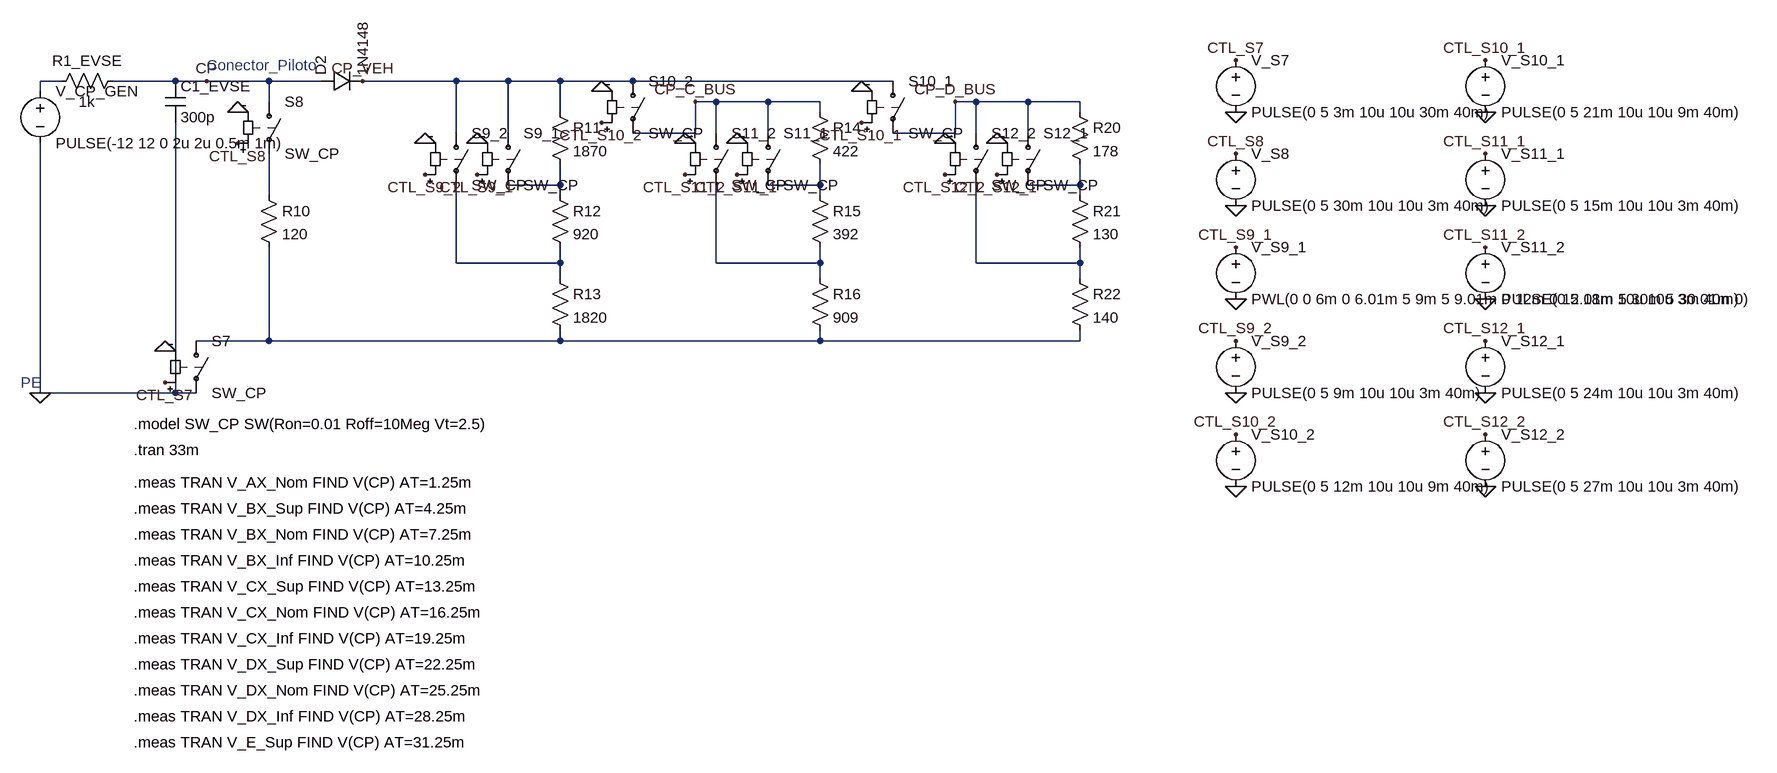
[diagram p0: schematic teste3.asc]
teste3.asc, the LTspice schematic file:
Version 4.1
SHEET 1 2500 1200
WIRE -208 48 -240 48
WIRE -240 48 -240 64
WIRE -32 48 -128 48
WIRE 16 48 -32 48
WIRE 112 48 16 48
WIRE 192 48 112 48
WIRE 112 80 112 48
WIRE 112 224 112 160
WIRE 112 448 112 304
WIRE 400 48 256 48
WIRE 480 48 400 48
WIRE 560 48 480 48
WIRE 672 48 560 48
WIRE 1072 48 672 48
WIRE 560 96 560 48
WIRE 560 224 560 176
WIRE 560 352 560 304
WIRE 560 448 560 432
WIRE 480 128 480 48
WIRE 560 208 480 208
WIRE 400 128 400 48
WIRE 400 328 400 208
WIRE 560 328 400 328
WIRE 768 128 672 128
WIRE 768 80 768 128
WIRE 800 80 768 80
WIRE 880 80 800 80
WIRE 960 80 880 80
WIRE 960 96 960 80
WIRE 960 224 960 176
WIRE 960 352 960 304
WIRE 960 448 960 432
WIRE 880 128 880 80
WIRE 960 208 880 208
WIRE 800 128 800 80
WIRE 800 328 800 208
WIRE 960 328 800 328
WIRE 1168 128 1072 128
WIRE 1168 80 1168 128
WIRE 1200 80 1168 80
WIRE 1280 80 1200 80
WIRE 1360 80 1280 80
WIRE 1360 96 1360 80
WIRE 1360 224 1360 176
WIRE 1360 352 1360 304
WIRE 1360 448 1360 432
WIRE 1280 128 1280 80
WIRE 1360 208 1280 208
WIRE 1200 128 1200 80
WIRE 1200 328 1200 208
WIRE 1360 328 1200 328
WIRE 112 448 0 448
WIRE 560 448 112 448
WIRE 960 448 560 448
WIRE 1360 448 960 448
WIRE -32 528 0 528
WIRE -240 528 -32 528
WIRE -240 528 -240 144
WIRE -32 528 -32 112
FLAG 16 48 CP
FLAG 256 48 CP_VEH
FLAG 768 80 CP_C_BUS
FLAG 1168 80 CP_D_BUS
FLAG -240 528 0
TEXT -270 512 Left 2 PE
TEXT 16 24 Left 2 Conector_Piloto
FLAG 64 96 0
FLAG 64 144 CTL_S8
FLAG 432 144 0
FLAG 432 192 CTL_S9_1
FLAG 352 144 0
FLAG 352 192 CTL_S9_2
FLAG 624 64 0
FLAG 624 112 CTL_S10_2
FLAG 1024 64 0
FLAG 1024 112 CTL_S10_1
FLAG 832 144 0
FLAG 832 192 CTL_S11_1
FLAG 752 144 0
FLAG 752 192 CTL_S11_2
FLAG 1232 144 0
FLAG 1232 192 CTL_S12_1
FLAG 1152 144 0
FLAG 1152 192 CTL_S12_2
FLAG -48 464 0
FLAG -48 512 CTL_S7
FLAG 1600 96 0
FLAG 1600 16 CTL_S7
FLAG 1600 240 0
FLAG 1600 160 CTL_S8
FLAG 1600 384 0
FLAG 1600 304 CTL_S9_1
FLAG 1600 528 0
FLAG 1600 448 CTL_S9_2
FLAG 1600 672 0
FLAG 1600 592 CTL_S10_2
FLAG 1984 96 0
FLAG 1984 16 CTL_S10_1
FLAG 1984 240 0
FLAG 1984 160 CTL_S11_1
FLAG 1984 384 0
FLAG 1984 304 CTL_S11_2
FLAG 1984 528 0
FLAG 1984 448 CTL_S12_1
FLAG 1984 672 0
FLAG 1984 592 CTL_S12_2
SYMBOL voltage -240 48 R0
WINDOW 123 0 0 Left 0
WINDOW 39 0 0 Left 0
SYMATTR InstName V_CP_GEN
SYMATTR Value PULSE(-12 12 0 2u 2u 0.5m 1m)
SYMBOL res -112 32 R90
WINDOW 0 0 56 VBottom 2
WINDOW 3 32 56 VTop 2
SYMATTR InstName R1_EVSE
SYMATTR Value 1k
SYMBOL cap -48 48 R0
SYMATTR InstName C1_EVSE
SYMATTR Value 300p
SYMBOL sw 112 64 R0
SYMATTR InstName S8
SYMATTR Value SW_CP
SYMBOL res 96 208 R0
SYMATTR InstName R10
SYMATTR Value 120
SYMBOL diode 192 64 R270
SYMATTR InstName D2
SYMATTR Value 1N4148
SYMBOL sw 0 432 R0
SYMATTR InstName S7
SYMATTR Value SW_CP
SYMBOL sw 480 112 R0
SYMATTR InstName S9_1
SYMATTR Value SW_CP
SYMBOL sw 400 112 R0
SYMATTR InstName S9_2
SYMATTR Value SW_CP
SYMBOL res 544 80 R0
SYMATTR InstName R11
SYMATTR Value 1870
SYMBOL res 544 208 R0
SYMATTR InstName R12
SYMATTR Value 920
SYMBOL res 544 336 R0
SYMATTR InstName R13
SYMATTR Value 1820
SYMBOL sw 672 32 R0
SYMATTR InstName S10_2
SYMATTR Value SW_CP
SYMBOL sw 880 112 R0
SYMATTR InstName S11_1
SYMATTR Value SW_CP
SYMBOL sw 800 112 R0
SYMATTR InstName S11_2
SYMATTR Value SW_CP
SYMBOL res 944 80 R0
SYMATTR InstName R14
SYMATTR Value 422
SYMBOL res 944 208 R0
SYMATTR InstName R15
SYMATTR Value 392
SYMBOL res 944 336 R0
SYMATTR InstName R16
SYMATTR Value 909
SYMBOL sw 1072 32 R0
SYMATTR InstName S10_1
SYMATTR Value SW_CP
SYMBOL sw 1280 112 R0
SYMATTR InstName S12_1
SYMATTR Value SW_CP
SYMBOL sw 1200 112 R0
SYMATTR InstName S12_2
SYMATTR Value SW_CP
SYMBOL res 1344 80 R0
SYMATTR InstName R20
SYMATTR Value 178
SYMBOL res 1344 208 R0
SYMATTR InstName R21
SYMATTR Value 130
SYMBOL res 1344 336 R0
SYMATTR InstName R22
SYMATTR Value 140
SYMBOL voltage 1600 0 R0
WINDOW 123 0 0 Left 0
WINDOW 39 0 0 Left 0
SYMATTR InstName V_S7
SYMATTR Value PULSE(0 5 3m 10u 10u 30m 40m)
SYMBOL voltage 1600 144 R0
WINDOW 123 0 0 Left 0
WINDOW 39 0 0 Left 0
SYMATTR InstName V_S8
SYMATTR Value PULSE(0 5 30m 10u 10u 3m 40m)
SYMBOL voltage 1600 288 R0
WINDOW 123 0 0 Left 0
WINDOW 39 0 0 Left 0
SYMATTR InstName V_S9_1
SYMATTR Value PWL(0 0 6m 0 6.01m 5 9m 5 9.01m 0 12m 0 12.01m 5 30m 5 30.01m 0)
SYMBOL voltage 1600 432 R0
WINDOW 123 0 0 Left 0
WINDOW 39 0 0 Left 0
SYMATTR InstName V_S9_2
SYMATTR Value PULSE(0 5 9m 10u 10u 3m 40m)
SYMBOL voltage 1600 576 R0
WINDOW 123 0 0 Left 0
WINDOW 39 0 0 Left 0
SYMATTR InstName V_S10_2
SYMATTR Value PULSE(0 5 12m 10u 10u 9m 40m)
SYMBOL voltage 1984 0 R0
WINDOW 123 0 0 Left 0
WINDOW 39 0 0 Left 0
SYMATTR InstName V_S10_1
SYMATTR Value PULSE(0 5 21m 10u 10u 9m 40m)
SYMBOL voltage 1984 144 R0
WINDOW 123 0 0 Left 0
WINDOW 39 0 0 Left 0
SYMATTR InstName V_S11_1
SYMATTR Value PULSE(0 5 15m 10u 10u 3m 40m)
SYMBOL voltage 1984 288 R0
WINDOW 123 0 0 Left 0
WINDOW 39 0 0 Left 0
SYMATTR InstName V_S11_2
SYMATTR Value PULSE(0 5 18m 10u 10u 3m 40m)
SYMBOL voltage 1984 432 R0
WINDOW 123 0 0 Left 0
WINDOW 39 0 0 Left 0
SYMATTR InstName V_S12_1
SYMATTR Value PULSE(0 5 24m 10u 10u 3m 40m)
SYMBOL voltage 1984 576 R0
WINDOW 123 0 0 Left 0
WINDOW 39 0 0 Left 0
SYMATTR InstName V_S12_2
SYMATTR Value PULSE(0 5 27m 10u 10u 3m 40m)
TEXT -96 576 Left 2 !.model SW_CP SW(Ron=0.01 Roff=10Meg Vt=2.5)
TEXT -96 616 Left 2 !.tran 33m
TEXT -96 666 Left 2 !.meas TRAN V_AX_Nom FIND V(CP) AT=1.25m
TEXT -96 706 Left 2 !.meas TRAN V_BX_Sup FIND V(CP) AT=4.25m
TEXT -96 746 Left 2 !.meas TRAN V_BX_Nom FIND V(CP) AT=7.25m
TEXT -96 786 Left 2 !.meas TRAN V_BX_Inf FIND V(CP) AT=10.25m
TEXT -96 826 Left 2 !.meas TRAN V_CX_Sup FIND V(CP) AT=13.25m
TEXT -96 866 Left 2 !.meas TRAN V_CX_Nom FIND V(CP) AT=16.25m
TEXT -96 906 Left 2 !.meas TRAN V_CX_Inf FIND V(CP) AT=19.25m
TEXT -96 946 Left 2 !.meas TRAN V_DX_Sup FIND V(CP) AT=22.25m
TEXT -96 986 Left 2 !.meas TRAN V_DX_Nom FIND V(CP) AT=25.25m
TEXT -96 1026 Left 2 !.meas TRAN V_DX_Inf FIND V(CP) AT=28.25m
TEXT -96 1066 Left 2 !.meas TRAN V_E_Sup FIND V(CP) AT=31.25m

The netlist it stands for:
* teste3.asc
V_CP_GEN N001 0 PULSE(-12 12 0 2u 2u 0.5m 1m)
R1_EVSE CP N001 1k
C1_EVSE CP 0 300p
S8 CP N002 CTL_S8 0 SW_CP
R10 N002 N003 120
D2 CP CP_VEH 1N4148
S7 N003 0 CTL_S7 0 SW_CP
S9_1 CP_VEH N004 CTL_S9_1 0 SW_CP
S9_2 CP_VEH N005 CTL_S9_2 0 SW_CP
R11 CP_VEH N004 1870
R12 N004 N005 920
R13 N005 N003 1820
S10_2 CP_VEH CP_C_BUS CTL_S10_2 0 SW_CP
S11_1 CP_C_BUS N006 CTL_S11_1 0 SW_CP
S11_2 CP_C_BUS N007 CTL_S11_2 0 SW_CP
R14 CP_C_BUS N006 422
R15 N006 N007 392
R16 N007 N003 909
S10_1 CP_VEH CP_D_BUS CTL_S10_1 0 SW_CP
S12_1 CP_D_BUS N008 CTL_S12_1 0 SW_CP
S12_2 CP_D_BUS N009 CTL_S12_2 0 SW_CP
R20 CP_D_BUS N008 178
R21 N008 N009 130
R22 N009 N003 140
V_S7 CTL_S7 0 PULSE(0 5 3m 10u 10u 30m 40m)
V_S8 CTL_S8 0 PULSE(0 5 30m 10u 10u 3m 40m)
V_S9_1 CTL_S9_1 0 PWL(0 0 6m 0 6.01m 5 9m 5 9.01m 0 12m 0 12.01m 5 30m 5 30.01m 0)
V_S9_2 CTL_S9_2 0 PULSE(0 5 9m 10u 10u 3m 40m)
V_S10_2 CTL_S10_2 0 PULSE(0 5 12m 10u 10u 9m 40m)
V_S10_1 CTL_S10_1 0 PULSE(0 5 21m 10u 10u 9m 40m)
V_S11_1 CTL_S11_1 0 PULSE(0 5 15m 10u 10u 3m 40m)
V_S11_2 CTL_S11_2 0 PULSE(0 5 18m 10u 10u 3m 40m)
V_S12_1 CTL_S12_1 0 PULSE(0 5 24m 10u 10u 3m 40m)
V_S12_2 CTL_S12_2 0 PULSE(0 5 27m 10u 10u 3m 40m)
.model D D
.lib standard.dio
* PE
* Conector_Piloto
.model SW_CP SW(Ron=0.01 Roff=10Meg Vt=2.5)
.tran 33m
.meas TRAN V_AX_Nom FIND V(CP) AT=1.25m
.meas TRAN V_BX_Sup FIND V(CP) AT=4.25m
.meas TRAN V_BX_Nom FIND V(CP) AT=7.25m
.meas TRAN V_BX_Inf FIND V(CP) AT=10.25m
.meas TRAN V_CX_Sup FIND V(CP) AT=13.25m
.meas TRAN V_CX_Nom FIND V(CP) AT=16.25m
.meas TRAN V_CX_Inf FIND V(CP) AT=19.25m
.meas TRAN V_DX_Sup FIND V(CP) AT=22.25m
.meas TRAN V_DX_Nom FIND V(CP) AT=25.25m
.meas TRAN V_DX_Inf FIND V(CP) AT=28.25m
.meas TRAN V_E_Sup FIND V(CP) AT=31.25m
.backanno
.end